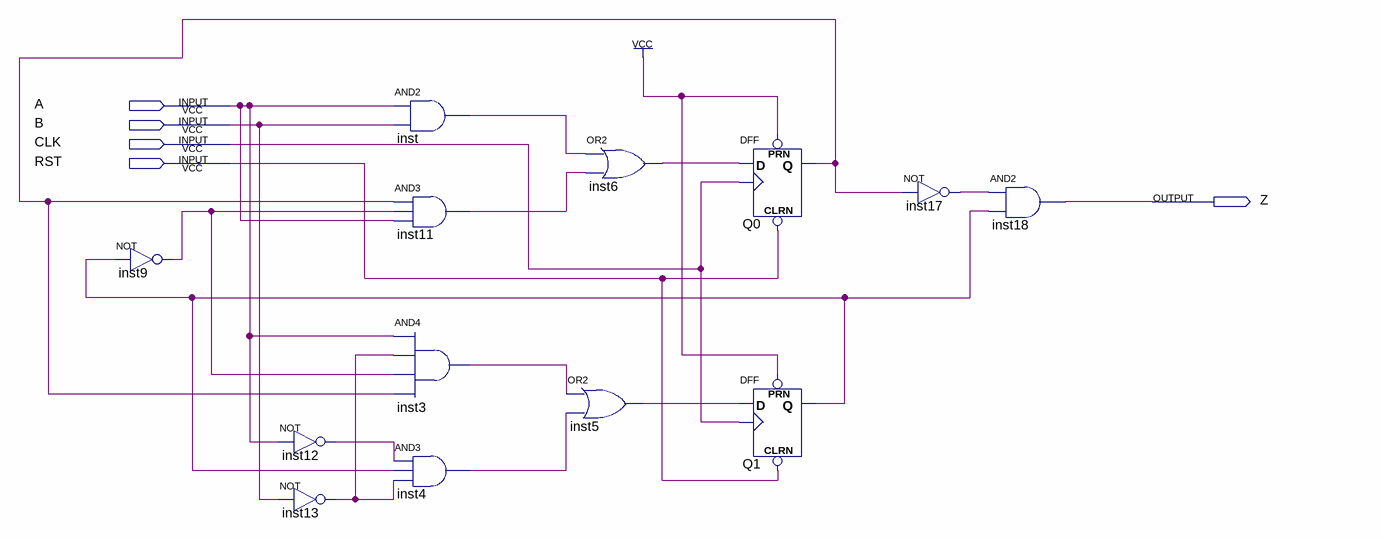
[diagram p0: schematic sheet]
// Quartus schematic ex9.bdf as structural Verilog: 13 symbols, 5 pins
module ex9 (
  input  A,
  input  B,
  input  CLK,
  input  RST,
  output Z
);

  wire inst3_out, inst4_out, inst5_out, inst6_out, inst9_out, inst11_out, inst12_out, inst13_out, inst17_out,
       inst_out, Q0_q, Q1_q;

  not inst9 (inst9_out, Q1_q);
  not inst12 (inst12_out, A);
  not inst13 (inst13_out, B);
  and inst (inst_out, A, B);
  and inst11 (inst11_out, Q0_q, inst9_out, A);
  and inst3 (inst3_out, A, inst13_out, inst9_out, Q0_q);
  and inst4 (inst4_out, inst12_out, Q1_q, inst13_out);
  or inst6 (inst6_out, inst_out, inst11_out);
  or inst5 (inst5_out, inst3_out, inst4_out);
  DFF Q0 (.CLRN(RST), .CLK(CLK), .D(inst6_out), .PRN(1'b1), .Q(Q0_q));
  DFF Q1 (.CLRN(RST), .CLK(CLK), .D(inst5_out), .PRN(1'b1), .Q(Q1_q));
  not inst17 (inst17_out, Q0_q);
  and inst18 (Z, inst17_out, Q1_q);
endmodule
